# Altium schematic sheet Sheet2.SchDoc
size A4
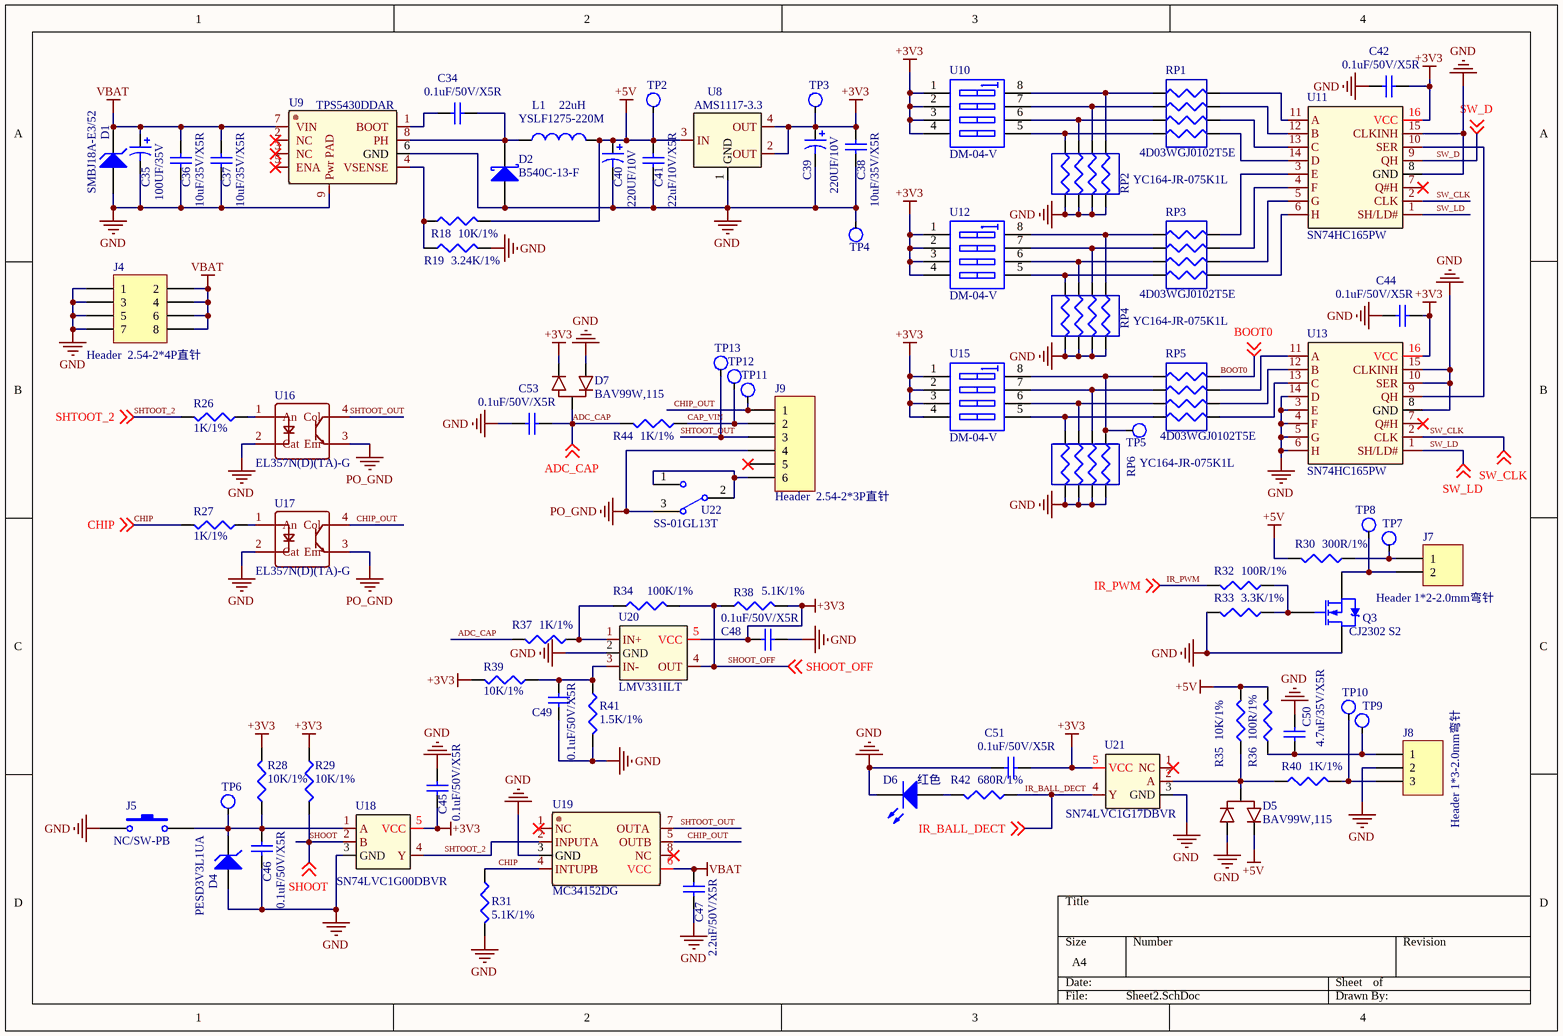
[diagram p0: Sheet2.SchDoc]

## Parts
C34  0.1uF/50V/X5R  [C0603]
C35  100UF/35V  [SMD_5X5.4]
C36  10uF/35V/X5R  [C1206]
C37  10uF/35V/X5R  [C1206]
C38  10uF/35V/X5R  [C0805]
C39  220UF/10V  [SMD_5X5.4]
C40  220UF/10V  [SMD_5X5.4]
C41  22uF/10V/X5R  [C0805]
C42  0.1uF/50V/X5R  [C0603]
C44  0.1uF/50V/X5R  [C0603]
C45  0.1uF/50V/X5R  [C0603]
C46  0.1uF/50V/X5R  [C0603]
C47  2.2uF/50V/X5R  [C0603]
C48  0.1uF/50V/X5R  [C0603]
C49  0.1uF/50V/X5R  [C0603]
C50  4.7uF/35V/X5R  [C0603]
C51  0.1uF/50V/X5R  [C0603]
C53  0.1uF/50V/X5R  [C0603]
D1  SMBJ18A-E3/52  [SMB]
D2  B540C-13-F  [SMC]
D4  PESD3V3L1UA  [SOD-323]
D5  BAV99W,115
D6  红色  [LED0603]
D7  BAV99W,115
J4  Header  2.54-2*4P直针  [DIP_2X4_2.54]
J5  NC/SW-PB  [SMD-AJ]
J7  Header 1*2-2.0mm弯针  [DIP_1X2_2MM1]
J8  Header 1*3-2.0mm弯针  [DIP_1X3_2MM]
J9  Header  2.54-2*3P直针  [DIP_2X3_2.54]
L1  YSLF1275-220M  value 22uH  [SMD_12.5X12.]
Q3  CJ2302 S2  [SOT-23]
R18  10K/1%  [R0603]
R19  3.24K/1%  [R0603]
R26  1K/1%  [R0603]
R27  1K/1%  [R0603]
R28  10K/1%  [R0603]
R29  10K/1%  [R0603]
R30  300R/1%  [R0603]
R31  5.1K/1%  [R0603]
R32  100R/1%  [R0603]
R33  3.3K/1%  [R0603]
R34  100K/1%  [R0603]
R35  10K/1%  [R0603]
R36  100R/1%  [R0603]
R37  1K/1%  [R0603]
R38  5.1K/1%  [R0603]
R39  10K/1%  [R0603]
R40  1K/1%  [R0603]
R41  1.5K/1%  [R0603]
R42  680R/1%  [R0603]
R44  1K/1%  [R0603]
RP1  4D03WGJ0102T5E  [RP-1206]
RP2  YC164-JR-075K1L  [RP-1206]
RP3  4D03WGJ0102T5E  [RP-1206]
RP4  YC164-JR-075K1L  [RP-1206]
RP5  4D03WGJ0102T5E  [RP-1206]
RP6  YC164-JR-075K1L  [RP-1206]
TP2  TP  [TP]  (value not drawn)
TP3  TP  [TP]  (value not drawn)
TP4  TP  [TP]  (value not drawn)
TP5  TP  [TP]  (value not drawn)
TP6  TP  [TP]  (value not drawn)
TP7  TP  [TP]  (value not drawn)
TP8  TP  [TP]  (value not drawn)
TP9  TP  [TP]  (value not drawn)
TP10  TP  [TP]  (value not drawn)
TP11  TP  [TP]  (value not drawn)
TP12  TP  [TP]  (value not drawn)
TP13  TP  [TP]  (value not drawn)
U8  AMS1117-3.3  [SOT-223]
U9  TPS5430DDAR  [SO-8]
U10  DM-04-V  [SMD_DM04]
U11  SN74HC165PW  [TSSOP-16]
U12  DM-04-V  [SMD_DM04]
U13  SN74HC165PW  [TSSOP-16]
U15  DM-04-V  [SMD_DM04]
U16  EL357N(D)(TA)-G  [SOP-4_P2.54]
U17  EL357N(D)(TA)-G  [SOP-4_P2.54]
U18  SN74LVC1G00DBVR  [SOT-23-5]
U19  MC34152DG  [SOIC-8]
U20  LMV331ILT  [SOT-23-5]
U21  SN74LVC1G17DBVR  [SOT-23-5]
U22  SS-01GL13T  [SW-6.4X19.8]

## Nets
+3V3: C38.1 C39.1 C42.1 C44.1 C45.1 C48.2 C51.1 D7.2 R28.2 R29.1 R38.2 R39.2 TP3.1 U8.2(OUT) U8.4(OUT) U10.1(A1) U10.2(A2) U10.3(A3) U10.4(A4) U11.16(VCC) U12.1(A1) U12.2(A2) U12.3(A3) U12.4(A4) U13.16(VCC) U15.1(A1) U15.2(A2) U15.3(A3) U15.4(A4) U18.5(VCC) U20.5(VCC) U21.5(VCC)
+5V: C40.1 C41.1 D5.2 L1.1 R18.2 R30.2 R35.2 R36.2 TP2.1 U8.3(IN)
GND: C35.2 C36.2 C37.2 C38.2 C39.2 C40.2 C41.2 C42.2 C44.2 C45.2 C46.2 C47.2 C48.1 C49.2 C50.2 C51.2 C53.2 D1.1(A) D2.1(A) D4.2(A) D5.1 D6.2(K) D7.1 J4.1 J4.3 J4.5 J4.7 J5.2 J8.2 Q3.2(D) R19.2 R31.2 R33.2 R41.2 RP2.5 RP2.6 RP2.7 RP2.8 RP4.5 RP4.6 RP4.7 RP4.8 RP6.5 RP6.6 RP6.7 RP6.8 TP4.1 U8.1(GND) U9.6(GND) U9.9(Pwr_PAD) U11.8(GND) U11.15(CLKINH) U13.3(E) U13.4(F) U13.5(G) U13.6(H) U13.8(GND) U13.10(SER) U13.14(D) U13.15(CLKINH) U16.2(Cat) U17.2(Cat) U18.3(GND) U19.3(GND) U20.2(GND) U21.3(GND)
PO_GND: J9.4 U16.3(Em) U17.3(Em) U22.3
VBAT: C35.1 C36.1 C37.1 C47.1 D1.2(K) J4.2 J4.4 J4.6 J4.8 U9.7(VIN) U19.6(VCC)
ADC_CAP: C53.1 D7.3 R37.2 R44.2 ; off-sheet ADC_CAP
BOOT0: RP5.1 ; off-sheet BOOT0
CAP_VIN: J9.2 R44.1 TP12.1
CHIP: R27.2 R31.1 U19.4(INTUPB) ; off-sheet CHIP
CHIP_OUT: J9.1 TP11.1 U17.4(Col) U19.5(OUTB)
IR_BALL_DECT: R42.1 U21.4(Y) ; off-sheet IR_BALL_DECT
IR_PWM: R32.2 ; off-sheet IR_PWM
SHOOT: R29.2 U18.2(B) ; off-sheet SHOOT
SHOOT_OFF: R34.2 R38.1 U20.4(OUT) ; off-sheet SHOOT_OFF
SHTOOT_2: R26.2 U18.4(Y) U19.2(INPUTA) ; off-sheet SHTOOT_2
SHTOOT_OUT: J9.3 TP13.1 U16.4(Col) U19.7(OUTA)
SW_CLK: U11.2(CLK) U13.2(CLK) ; off-sheet SW_CLK
SW_D: U11.9(QH) ; off-sheet SW_D
SW_LD: U11.1(SH/LD#) U13.1(SH/LD#) ; off-sheet SW_LD
NetC34_1: C34.1 U9.1(BOOT)
NetC34_2: C34.2 D2.2(K) L1.2 U9.8(PH)
NetC46_1: C46.1 D4.1(K) J5.1 R28.1 TP6.1 U18.1(A)
NetC49_1: C49.1 R39.1 R41.1 U20.3(IN-)
NetC50_1: C50.1 J8.1 R36.1 TP9.1
NetD5_3: D5.3 R35.1 R40.1 U21.2(A)
NetD6_1: D6.1(A) R42.2
NetJ7_1: J7.1 R30.1 TP7.1
NetJ7_2: J7.2 Q3.3(S) TP8.1
NetJ8_3: J8.3 R40.2 TP10.1
NetJ9_6: J9.6 U22.1 U22.2
NetQ3_1: Q3.1(G) R32.1 R33.1
NetR18_1: R18.1 R19.1 U9.4(VSENSE)
NetR26_1: R26.1 U16.1(An)
NetR27_1: R27.1 U17.1(An)
NetR34_1: R34.1 R37.1 U20.1(IN+)
NetRP1_1: RP1.1 U11.11(A)
NetRP1_2: RP1.2 U11.12(B)
NetRP1_3: RP1.3 U11.13(C)
NetRP1_4: RP1.4 U11.14(D)
NetRP1_5: RP1.5 RP2.4 U10.5(B4)
NetRP1_6: RP1.6 RP2.3 U10.6(B3)
NetRP1_7: RP1.7 RP2.2 U10.7(B2)
NetRP1_8: RP1.8 RP2.1 U10.8(B1)
NetRP3_1: RP3.1 U11.3(E)
NetRP3_2: RP3.2 U11.4(F)
NetRP3_3: RP3.3 U11.5(G)
NetRP3_4: RP3.4 U11.6(H)
NetRP3_5: RP3.5 RP4.4 U12.5(B4)
NetRP3_6: RP3.6 RP4.3 U12.6(B3)
NetRP3_7: RP3.7 RP4.2 U12.7(B2)
NetRP3_8: RP3.8 RP4.1 U12.8(B1)
NetRP5_2: RP5.2 U13.11(A)
NetRP5_3: RP5.3 U13.12(B)
NetRP5_4: RP5.4 U13.13(C)
NetRP5_5: RP5.5 RP6.4 U15.5(B4)
NetRP5_6: RP5.6 RP6.3 U15.6(B3)
NetRP5_7: RP5.7 RP6.2 U15.7(B2)
NetRP5_8: RP5.8 RP6.1 TP5.1 U15.8(B1)
NetU11_10: U11.10(SER) U13.9(QH)

Not connected (* = marked no-connect by the designer): J9 5*; U9 2(NC)* 3(NC)* 5(ENA)*; U11 7(Q#H)*; U13 7(Q#H)*; U19 1(NC)* 8(NC)*; U21 1(NC)*

## Library data of the parts
C34 C36-C38 C41 C42 C44-C51 C53 = Cap Semi: Capacitor (Semiconductor SIM Model); Value: 100pF; Published: 8-Jun-2000; LatestRevisionDate: 29-May-2009; LatestRevisionNote: IPC-7351 Footprint Added.; PackageReference: C1206; Publisher: Altium Limited; PackageDescription: Chip Capacitor
C35 C39 C40 = Cap Pol1: Polarized Capacitor (Radial); Value: 100pF; Published: 8-Jun-2000; LatestRevisionDate: 17-Jul-2002; LatestRevisionNote: Re-released for DXP Platform.; PackageReference: RB7.6-15; Publisher: Altium Limited; PackageDescription: Polarized Capacitor (Radial); 2 Leads
D1 = D Zener: Zener Diode; Published: 8-Jun-2000; LatestRevisionDate: 17-Jul-2002; LatestRevisionNote: Re-released for DXP Platform.; PackageReference: DIODE-0.7; Publisher: Altium Limited; PackageDescription: Diode, Thru-Hole; 2 Leads; 0.7 in Pin Spacing
D2 = D Schottky: Schottky Diode; Published: 8-Jun-2000; LatestRevisionDate: 17-Jul-2002; LatestRevisionNote: Re-released for DXP Platform.; PackageReference: SMB; Publisher: Altium Limited; PackageDescription: DO-214-AA/SMB; 2 C-Bend Leads; Body 5.3 x 3.6 mm, inc. leads (LxW); Code_JEDEC: DO-214-AA
D6 = LED2: Typical RED, GREEN, YELLOW, AMBER GaAs LED; Published: 8-Jun-2000; LatestRevisionDate: 17-Jul-2002; LatestRevisionNote: Re-released for DXP Platform.; PackageVersion: Feb-2002; PackageReference: 3.2X1.6X1.1; Publisher: Altium Limited; PackageDescription: SM LED; 2 Flat Leads
J4 = Header 4X2: Header, 4-Pin, Dual row; LatestRevisionDate: 17-Jul-2002; LatestRevisionNote: Re-released for DXP Platform.; Publisher: Altium Limited
J5 = SW-PB: Switch; Published: 24-Mar-1999; LatestRevisionDate: 17-Jul-2002; LatestRevisionNote: Re-released for DXP Platform.; PackageReference: SPST-2; Publisher: Altium Limited; PackageDescription: Switch; 2 Leads
J7 = Header 2: Header, 2-Pin; LatestRevisionDate: 17-Jul-2002; LatestRevisionNote: Re-released for DXP Platform.; Publisher: Altium Limited
J8 = Header 3: Header, 3-Pin; LatestRevisionDate: 17-Jul-2002; LatestRevisionNote: Re-released for DXP Platform.; Publisher: Altium Limited
J9 = Header 6: Header, 6-Pin; LatestRevisionDate: 17-Jul-2002; LatestRevisionNote: Re-released for DXP Platform.; Publisher: Altium Limited
L1 = Inductor: Code_IEC: 1005; Published: 8-Jun-2000; LatestRevisionDate: 29-May-2009; LatestRevisionNote: IPC-7351 Footprint Added.; PackageReference: 0402-A; Publisher: Altium Limited; PackageDescription: Chip Inductor; Code_JEITA: 0402
Q3 = NMOS-2: N-Channel Power MOSFET; Note: Pin 2 is electrically connected to pin 4.; Published: 8-Jun-2000; LatestRevisionDate: 17-Jul-2002; LatestRevisionNote: Re-released for DXP Platform.; DatasheetVersion: PD-9.814; PackageVersion: Feb-1997; PackageReference: TO-220AB; Publisher: Altium Limited; PackageDescription: TO, Thru-Hole, Vertical, Heatsink Mounted; 3 In-Line Leads; Pitch 2.54 mm; ComponentLink1Description: Manufacturer Link; ComponentLink1URL: http://www.irf.com/
R18 R19 R26-R42 R44 = Res3: Resistor; Value: 1K; Published: 8-Jun-2000; LatestRevisionDate: 29-May-2009; LatestRevisionNote: IPC-7351 Footprint Added.; PackageReference: J1-0603; Publisher: Altium Limited; PackageDescription: Chip Resistor
RP1-RP6 = RP
U10 U12 U15 = SW DIP-4: DIP Switch, 4 Position, SPST; Published: 24-Mar-1999; LatestRevisionDate: 29-May-2009; LatestRevisionNote: IPC-7351 Footprint Added.; PackageVersion: Dec-2002; PackageReference: SO8; Publisher: Altium Limited; PackageDescription: 8-Pin Small Outline Integrated Circuit 1.27 mm Pitch; Code_JEDEC: MS-012-AA; Code_IPC: SOIC127P600-8
U20 = LMV331IDBVR
U22 = SW-SPDT: SPDT Subminiature Toggle Switch, Right Angle Mounting, Vertical Actuation; Published: 24-Mar-1999; LatestRevisionDate: 17-Dec-2003; LatestRevisionNote: Schematic revised, PCB Footprint replaced.; DatasheetVersion: 05-Dec-2000; PackageReference: TL36WW15050; Publisher: Altium Limited; PackageDescription: Switch; 4 Leads; ComponentLink1Description: Manufacturer Link; ComponentLink1URL: http://www.apem.com